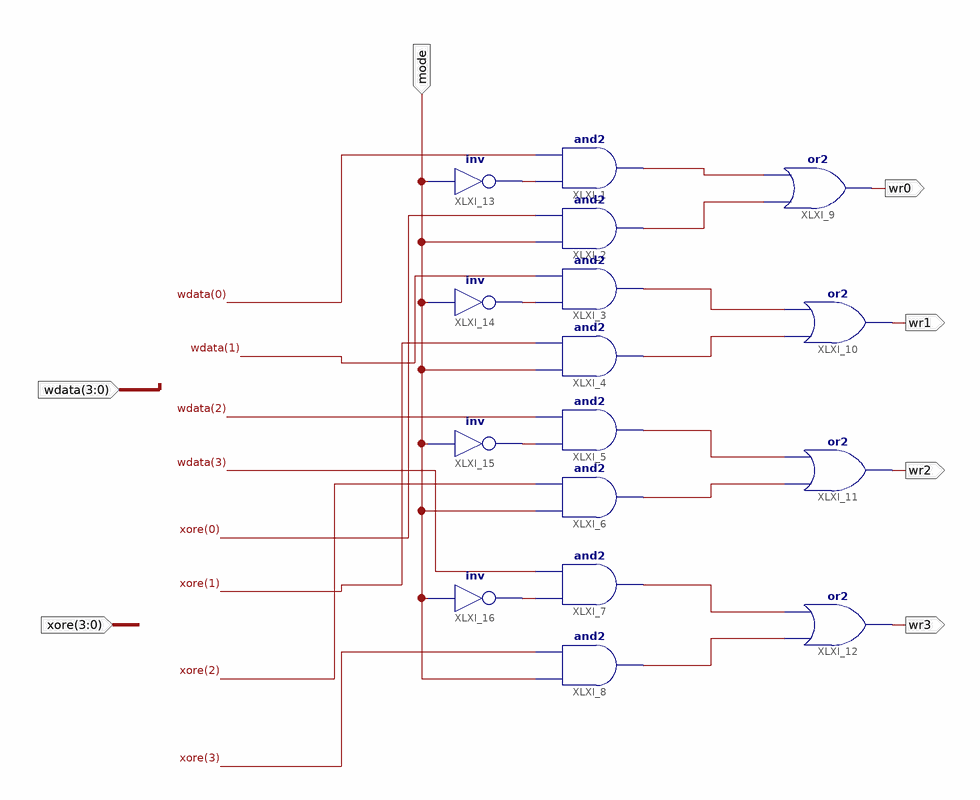
[diagram p0: schematic sheet 1]
// Xilinx ISE schematic mux8_4.sch (artix7) as structural Verilog: 16 symbols, 7 ports
module mux8_4 (
  input  mode,
  input  [3:0] wdata,
  input  [3:0] xore,
  output wr0,
  output wr1,
  output wr2,
  output wr3
);

  wire XLXN_16, XLXN_18, XLXN_19, XLXN_20, XLXN_21, XLXN_22, XLXN_23, XLXN_24, XLXN_25, XLXN_26, XLXN_27,
       XLXN_28;

  and XLXI_1 (XLXN_21, XLXN_16, wdata[0]);
  and XLXI_2 (XLXN_22, mode, xore[0]);
  and XLXI_3 (XLXN_23, XLXN_18, wdata[1]);
  and XLXI_4 (XLXN_24, mode, xore[1]);
  and XLXI_5 (XLXN_25, XLXN_19, wdata[2]);
  and XLXI_6 (XLXN_26, mode, xore[2]);
  and XLXI_7 (XLXN_27, XLXN_20, wdata[3]);
  and XLXI_8 (XLXN_28, mode, xore[3]);
  or XLXI_9 (wr0, XLXN_22, XLXN_21);
  or XLXI_10 (wr1, XLXN_24, XLXN_23);
  or XLXI_11 (wr2, XLXN_26, XLXN_25);
  or XLXI_12 (wr3, XLXN_28, XLXN_27);
  not XLXI_13 (XLXN_16, mode);
  not XLXI_14 (XLXN_18, mode);
  not XLXI_15 (XLXN_19, mode);
  not XLXI_16 (XLXN_20, mode);
endmodule
